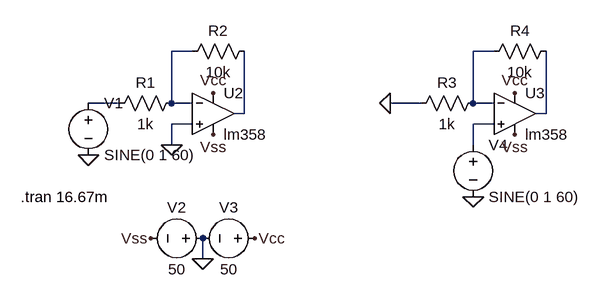
[diagram p0: schematic tem.asc]
tem.asc, the LTspice schematic file:
Version 4
SHEET 1 3964 2480
WIRE 3104 2128 3072 2128
WIRE 3568 2128 3536 2128
WIRE 2992 2208 2944 2208
WIRE 3072 2208 3072 2128
WIRE 3104 2208 3072 2208
WIRE 3456 2208 3408 2208
WIRE 3536 2208 3536 2128
WIRE 3568 2208 3536 2208
WIRE 3184 2224 3184 2128
WIRE 3184 2224 3168 2224
WIRE 3648 2224 3648 2128
WIRE 3648 2224 3632 2224
WIRE 3104 2240 3072 2240
WIRE 3568 2240 3536 2240
WIRE 3072 2272 3072 2240
WIRE 3536 2272 3536 2240
WIRE 3120 2448 3120 2416
FLAG 3072 2272 0
FLAG 2944 2288 0
FLAG 3120 2448 0
FLAG 3200 2416 Vcc
FLAG 3136 2192 Vcc
FLAG 3040 2416 Vss
FLAG 3136 2256 Vss
FLAG 3536 2352 0
FLAG 3408 2208 0
FLAG 3600 2192 Vcc
FLAG 3600 2256 Vss
SYMBOL voltage 2944 2192 R0
WINDOW 123 0 0 Left 0
WINDOW 39 0 0 Left 0
SYMATTR InstName V1
SYMATTR Value SINE(0 1 60)
SYMBOL res 3088 2192 R90
WINDOW 0 0 56 VBottom 2
WINDOW 3 32 56 VTop 2
SYMATTR InstName R1
SYMATTR Value 1k
SYMBOL res 3200 2112 R90
WINDOW 0 0 56 VBottom 2
WINDOW 3 32 56 VTop 2
SYMATTR InstName R2
SYMATTR Value 10k
SYMBOL voltage 3136 2416 R90
WINDOW 0 -32 56 VBottom 2
WINDOW 3 32 56 VTop 2
WINDOW 123 0 0 Left 0
WINDOW 39 0 0 Left 0
SYMATTR InstName V2
SYMATTR Value 50
SYMBOL voltage 3216 2416 R90
WINDOW 0 -32 56 VBottom 2
WINDOW 3 32 56 VTop 2
WINDOW 123 0 0 Left 0
WINDOW 39 0 0 Left 0
SYMATTR InstName V3
SYMATTR Value 50
SYMBOL voltage 3536 2256 R0
WINDOW 123 0 0 Left 0
WINDOW 39 0 0 Left 0
SYMATTR InstName V4
SYMATTR Value SINE(0 1 60)
SYMBOL res 3552 2192 R90
WINDOW 0 0 56 VBottom 2
WINDOW 3 32 56 VTop 2
SYMATTR InstName R3
SYMATTR Value 1k
SYMBOL res 3664 2112 R90
WINDOW 0 0 56 VBottom 2
WINDOW 3 32 56 VTop 2
SYMATTR InstName R4
SYMATTR Value 10k
SYMBOL OpAmps\\lm358 3600 2160 R0
SYMATTR InstName U3
SYMBOL OpAmps\\lm358 3136 2160 R0
SYMATTR InstName U2
TEXT 2840 2352 Left 2 !.tran 16.67m

The netlist it stands for:
* tem.asc
V1 N003 0 SINE(0 1 60)
R1 N001 N003 1k
R2 N004 N001 10k
V2 0 Vss 50
V3 Vcc 0 50
V4 N006 0 SINE(0 1 60)
R3 N002 0 1k
R4 N005 N002 10k
XU3 N006 N002 Vcc Vss N005 lm358  ; pins In+ In- V+ V- OUT
XU2 0 N001 Vcc Vss N004 lm358  ; pins In+ In- V+ V- OUT
.tran 16.67m
.backanno
.end